# Altium schematic sheet Morpheus_NDO.SchDoc: LDO with Boost Converter
size Letter; CompanyName: Hello Inc.; DrawnBy: Dyke Shaffer; Organization: Hello Inc.; Revision: DVT; SheetNumber: 2; SheetTotal: 4
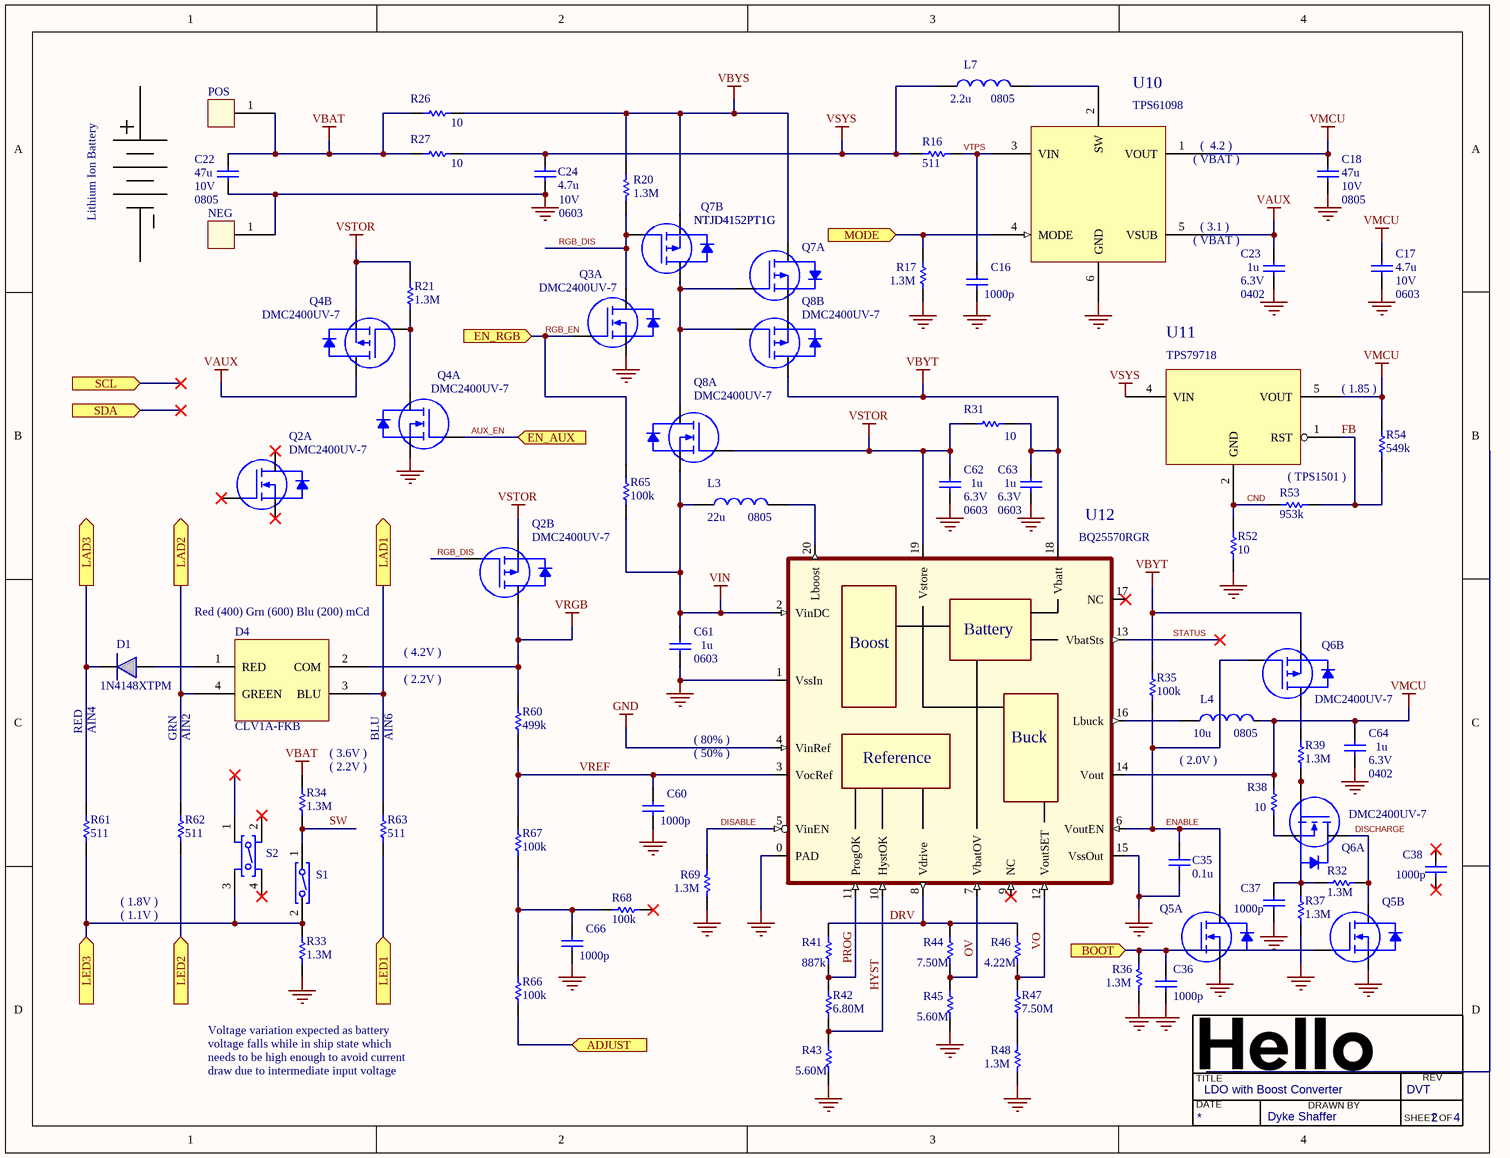
[diagram p0: Morpheus_NDO.SchDoc]

## Parts
C16  1000p  [0402C20X24]
C17  4.7u  Size: 0603  Voltage: 10V  [CAP0603_SENSE_DVT]
C18  47u  Size: 0805  Voltage: 10V  [0805C45X55]
C22  47u  Size: 0805  Voltage: 10V  [0805C45X55]
C23  1u  Size: 0402  Voltage: 6.3V  [CAP0402_SENSE_DVT]
C24  4.7u  Size: 0603  Voltage: 10V  [CAP0603_SENSE_DVT]
C35  0.1u  [CAP0402_SENSE_DVT]
C36  1000p  [0402C20X24]
C37  1000p  [0402C20X24]
C38  1000p  [0402C20X24]
C60  1000p  [0402C20X24]
C61  1u  Size: 0603  [CAP0603_SENSE_DVT]
C62  1u  Size: 0603  Voltage: 6.3V  [CAP0603_SENSE_DVT]
C63  1u  Size: 0603  Voltage: 6.3V  [CAP0603_SENSE_DVT]
C64  1u  Size: 0402  Voltage: 6.3V  [CAP0402_SENSE_DVT]
C66  1000p  [0402C20X24]
D1  1N4148XTPM  [SOD523]
D4  value Red (400) Grn (600) Blu (200) mCd  [PLCC150X290P280X320X190-4]  (hidden comment: CLV1A-FKB)
L3  22u  Size: 0805  [IND_0805]
L4  10u  Size: 0805  [IND_0805]
L7  2.2u  Size: 0805  [IND_0805]
NEG  (no value)  [TP80x50CP]
POS  (no value)  [TP80x50CP]
Q2  DMC2400UV-7  [SOT-563]  (parts A,B of 2)
Q3  DMC2400UV-7  [SOT-563]  (part A of 2)
Q4  DMC2400UV-7  [SOT-563]  (parts A,B of 2)
Q5  DMG6301UDW-7  [SOT-563]  (value not drawn)  (parts A,B of 2)
Q6  DMC2400UV-7  [SOT-563]  (parts A,B of 2)
Q7  NTJD4152PT1G  [SOT-563]  (parts A,B of 2)
Q8  DMC2400UV-7  [SOT-563]  (parts A,B of 2)
R16  511  [RES0402_SENSE_DVT]
R17  1.3M  [RES0402_SENSE_DVT]
R20  1.3M  [RES0402_SENSE_DVT]
R21  1.3M  [RES0402_SENSE_DVT]
R26  10  [RES0402_SENSE_DVT]
R27  10  [RES0402_SENSE_DVT]
R31  10  [RES0402_SENSE_DVT]
R32  1.3M  [RES0402_SENSE_DVT]
R33  1.3M  [RES0402_SENSE_DVT]
R34  1.3M  [RES0402_SENSE_DVT]
R35  100k  [RES0402_SENSE_DVT]
R36  1.3M  [RES0402_SENSE_DVT]
R37  1.3M  [RES0402_SENSE_DVT]
R38  10  [RES0402_SENSE_DVT]
R39  1.3M  [RES0402_SENSE_DVT]
R41  887k  [0402R18X20]
R42  6.80M  [0402R18X20]
R43  5.60M  [0402R18X20]
R44  7.50M  [0402R18X20]
R45  5.60M  [0402R18X20]
R46  4.22M  [0402R18X20]
R47  7.50M  [0402R18X20]
R48  1.3M  [0402R18X20]
R52  10  [RES0402_SENSE_DVT]
R53  953k  [RES0402_SENSE_DVT]
R54  value 549k  [RES0402_SENSE_DVT]
R60  499k  [RES0402_SENSE_DVT]
R61  511  [RES0402_SENSE_DVT]
R62  511  [RES0402_SENSE_DVT]
R63  511  [RES0402_SENSE_DVT]
R65  100k  [RES0402_SENSE_DVT]
R66  100k  [RES0402_SENSE_DVT]
R67  100k  [RES0402_SENSE_DVT]
R68  100k  [RES0402_SENSE_DVT]
R69  1.3M  [0402R18X20]
S1  REED_SPST_NO  [REED-10x1.8]  (value not drawn)
S2  REED_SPST_NO  [PLCC350X400P450X450X65-4]  (value not drawn)
U10  TPS61098  [DFN50P150X150X80-6N]
U11  TPS79718  [SOT65P212X110-5N]
U12  BQ25570RGR  [VQFN50P350X350X100-20]

## Ports
ADJUST (in), BOOT (in), EN_AUX (in), EN_RGB (in), LAD1 (out), LAD2 (out), LAD3 (out), LED1 (in), LED2 (in), LED3 (in), MODE (in), SCL (in), SDA (in)

## Nets
GND: C16.1 C17.1 C18.1 C22.1 C23.1 C24.1 C35.1 C36.1 C37.1 C60.1 C61.1 C62.1 C63.1 C64.1 C66.1 NEG.1 Q3.1(S1) Q4.1(S1) Q5.1(S1) Q5.4(S2) R17.2 R33.1 R36.1 R37.1 R43.1 R45.1 R48.1 R52.1 R69.1 U10.6(GND) U12.0(PAD) U12.1(VssIn) U12.4(VinRef) U12.15(VssOut)
VAUX: C23.2 Q4.3(D2) U10.5(VSUB)
VBAT: C22.2 POS.1 R26.1 R27.1 R34.2
VBYS: Q7.4(S2) Q7.6(D1) R20.2 R26.2
VBYT: C63.2 Q6.4(S2) Q8.3(D2) R31.1 R35.2 U12.18(Vbatt)
VIN: C61.2 L3.2 Q8.1(S1) R65.1 U12.2(VinDC)
VMCU: C17.2 C18.2 C64.2 L4.1 R38.2 R54.2 U10.1(VOUT) U11.5(VOUT) U12.14(Vout)
VRGB: D4.2(COM) Q2.3(D2) R60.2
VSTOR: C62.2 Q2.4(S2) Q4.4(S2) Q8.2(G1) R21.2 R31.2 U12.19(Vstore)
VSYS: C24.2 L7.2 R16.2 R27.2 U11.4(VIN)
ADJUST: R66.1 ; port ADJUST
AUX_EN: Q4.2(G1) ; port EN_AUX
BOOT: C36.2 Q5.2(G1) Q5.5(G2) R36.2 ; port BOOT
CND: R52.2 R53.1 U11.2(GND)
DISABLE: R69.2 U12.5(VinEN)
DISCHARGE: Q5.3(D2) Q6.6(D1) R32.1
DRV: R41.2 R44.2 R46.2 U12.8(Vdrive)
ENABLE: C35.2 Q5.6(D1) Q6.5(G2) R35.1 U12.6(VoutEN)
FB: R53.2 R54.1 U11.1(RST)
HYST: R42.1 R43.2 U12.10(HystOK)
LAD1: D4.3(BLU) R63.2 ; port LAD1
LAD2: D4.4(GREEN) R62.2 ; port LAD2
LAD3: D1.1(Cathode) R61.2 ; port LAD3
LED1: R63.1 ; port LED1
LED2: R62.1 ; port LED2
LED3: R33.2 R61.1 S1.2 S2.3 ; port LED3
MODE: R17.1 U10.4(MODE) ; port MODE
OV: R44.1 R45.2 U12.7(VbatOV)
PROG: R41.1 R42.2 U12.11(ProgOK)
RGB_DIS: Q2.5(G2) Q3.6(D1) Q7.5(G2) R20.1
RGB_EN: Q3.2(G1) R65.2 ; port EN_RGB
STATUS: U12.13(VbatSts)
SW: R34.1 S1.1
VO: R46.1 R47.2 U12.12(VoutSET)
VREF: C60.2 R60.1 R67.2 U12.3(VocRef)
VTPS: C16.2 R16.1 U10.3(VIN)
NetC37_2: C37.2 Q6.2(G1) R32.2 R37.2 R39.1
NetC66_2: C66.2 R66.2 R67.1 R68.2
NetD1_2: D1.2(Anode) D4.1(RED)
NetL3_1: L3.1 U12.20(Lboost)
NetL4_2: L4.2 U12.16(Lbuck)
NetL7_1: L7.1 U10.2(SW)
NetQ4_5: Q4.5(G2) Q4.6(D1) R21.1
NetQ6_1: Q6.1(S1) R38.1
NetQ6_3: Q6.3(D2) R39.2
NetQ7_1: Q7.1(S1) Q8.4(S2)
NetQ7_2: Q7.2(G1) Q7.3(D2) Q8.5(G2) Q8.6(D1)
NetR47_1: R47.1 R48.2

Not connected (* = marked no-connect by the designer): C38 1* 2*; Q2 1(S1)* 2(G1)* 6(D1)*; R68 1*; S2 1* 2* 4*; U12 9(NC)* 17(NC)*

## Notes on the sheet
- (near U10) ( VBAT )
- (near U10) (  4.2 )
- Lithium Ion Battery
- ( 3.1 )
- ( VBAT )
- ( 1.85 )
- (near U11) ( TPS1501 )
- ( 2.2V )
- ( 4.2V )
- RED
- (near D1) AIN4
- GRN
- AIN2
- ( 3.6V )
- BLU
- AIN6
- ( 80% )
- ( 50% )
- ( 2.0V )
- ( 1.8V )
- ( 1.1V )
- Voltage variation expected as battery
- voltage falls while in ship state which
- needs to be high enough to avoid current
- draw due to intermediate input voltage
- TITLE
- DATE
- DRAWN BY
- REV
- SHEET
- OF
- (in symbol BQ25570RGR) Battery; Boost; Buck; Reference

## Library data of the parts
C16 C36-C38 C60 C66 = C_1000p_10_50_X7R_0402: Chip capacitor; Vendor: Murata; PN: GRM155R71H102KA01D; Tolerance: 10%; Voltage: 50V; Temp: X7R; Value: 1000p; Size: 0402
C17 C24 = C_4.7u_20_10_X5R_0603: Chip capacitor; Vendor: TDK; PN: CGB3B1X5R1A475M055AC; Tolerance: 20%; Temp: X5R; Value: 4.7u
C18 C22 = C_47u_20_10_X5R_0805: Chip capacitor; Vendor: TDK; PN: C2012X5R1A476M125AC; Tolerance: 20%; Temp: X5R; Value: 47u
C23 C62-C64 = C_1u_10_6.3_X5R_0402: Chip capacitor; Vendor: Taiyo Yuden; PN: JMK105BJ105KV-F; Tolerance: 10%; Temp: X5R; Value: 1u
C35 = C_0.1u_10_50_X7R_0402: Chip capacitor; Vendor: Taiyo Yuden; PN: UMK105B7104KV-FR; Tolerance: 10%; Voltage: 50V; Temp: X7R; Value: 0.1u; Size: 0402
C61 = C_1u_10_6.3_X5R_0402: Chip capacitor; Vendor: Taiyo Yuden; PN: JMK105BJ105KV-F; Tolerance: 10%; Voltage: 6.3V; Temp: X5R; Value: 1u
D1 = 1N4148XTPM: Silicon diode, 30V 200mA; Vendor: ON Semi; PN: 1N4148XTPM
D4 = CLV1A-FKB: RGB LED Array; Vendor: CREE; PN: CLV1A-FKB
L3 = L_22u_0805: SMD power inductor, 22uH; Vendor: Murata; Tolerance: 20%; RDC: 0.19; I_max: 0.9; I_sat: 1.0; PN: ?; Value: 22u; Q: ?
L4 = L_10u_0805: SMD power inductor, 10uH; Vendor: Murata; Tolerance: 20%; RDC: 0.19; I_max: 0.9; I_sat: 1.0; PN: ?; Value: 10u; Q: ?
L7 = L_2.2u_0805: SMD power inductor, 2.2uH; Vendor: Murata; Tolerance: 20%; RDC: 0.19; I_max: 0.9; I_sat: 1.0; PN: ?; Value: 2.2u; Q: ?
NEG POS = 5016: Single-pad test point
Q2-Q4 Q6 Q8 = DMC2400UV-7: Dual PN-Channel MOSFET 1.2v drive 20V 0.88A; Vendor: Diodes Inc; PN: DMC2400UV-7
Q5 = DMG6301UDW-7: Vendor: Diodes Inc.; PN: DMG6301UDW-7
Q7 = NTJD4152PT1G: Dual P-Channel MOSFET 1.2v drive 20V 0.88A; Vendor: ON Semi; PN: NTJD4152PT1G
R16 R61-R63 = R_511_1_0.1_0402: Chip Resistor; Vendor: Panasonic; Tolerance: 1 %; Power: 0.1 W; PN: ERJ-2RKF5110X; Model: *; Value: 511; Size: 0402
R17 R20 R21 R32-R34 R36 R37 R39 R48 R69 = R_1.3M_5_0.1_0402: Chip Resistor; Vendor: Panasonic; Tolerance: 5 %; Power: 0.1 W; PN: ERJ-2GEJ135X; Model: *; Value: 1.3M; Size: 0402
R26 R27 R31 R38 R52 = R_10_1_0.1_0402: Chip Resistor; Vendor: Panasonic; Tolerance: 1 %; Power: 0.1 W; PN: ERJ-2RKF10R0X; Model: *; Value: 10; Size: 0402
R35 R65-R68 = R_100k_1_0.1_0402: Chip Resistor; Vendor: Panasonic; Tolerance: 1 %; Power: 0.1 W; PN: ERJ-2RKF1003X; Model: *; Value: 100k; Size: 0402
R41 = R_887k_1_0.1_0402: Chip Resistor; Vendor: Panasonic; Tolerance: 1 %; Power: 0.1 W; PN: ERJ-2RKF8873X; Model: *; Value: 887k; Size: 0402
R42 = R_6.80M_1_0.1_0402: Chip Resistor; Vendor: Vishay Dale; Tolerance: 1 %; Power: 0.1 W; PN: CRCW04026M80JNED; Model: *; Value: 6.80M; Size: 0402
R43 R45 = R_5.60M_1_0.1_0402: Chip Resistor; Vendor: Vishay Dale; Tolerance: 1 %; Power: 0.1 W; PN: CRCW04025M60JNED; Model: *; Value: 5.60M; Size: 0402
R44 R47 = R_7.50M_1_0.1_0402: Chip Resistor; Vendor: Vishay Dale; Tolerance: 1 %; Power: 0.1 W; PN: CRCW04027M50JNED; Model: *; Value: 7.50M; Size: 0402
R46 = R_4.22M_1_0.1_0402: Chip Resistor; Vendor: Vishay Dale; Tolerance: 1 %; Power: 0.1 W; PN: CRCW04024M22FKED; Model: *; Value: 4.22M; Size: 0402
R53 = R_953k_1_0.1_0402: Chip Resistor; Vendor: Panasonic; Tolerance: 1 %; Power: 0.1 W; PN: ERJ-2RKF9533X; Model: *; Value: 953k; Size: 0402
R54 = R_549k_1_0.1_0402: Chip Resistor; Vendor: Panasonic; Tolerance: 1 %; Power: 0.1 W; PN: ERJ-2RKF5493X; Model: *; Size: 0402
R60 = R_499k_1_0.1_0402: Chip Resistor; Vendor: Panasonic; Tolerance: 1 %; Power: 0.1 W; PN: ERJ-2RKF4993X; Model: *; Value: 499k; Size: 0402
S1 = SW_REED_SPST_NO: SWITCH REED SPST NO; PN: ORD213-1015; Vendor: ORD
S2 = SW_SPST_NO: SWITCH SPST NO; PN: <button switch>; Vendor: <push button>
U10 = TPS61098: Boost Converter
U11 = TPS79718DCK: LDO 1.8V SC70-5; PN: TPS79718DCKT